# EAGLE design BusPirate-v4a (EAGLE 5.07)
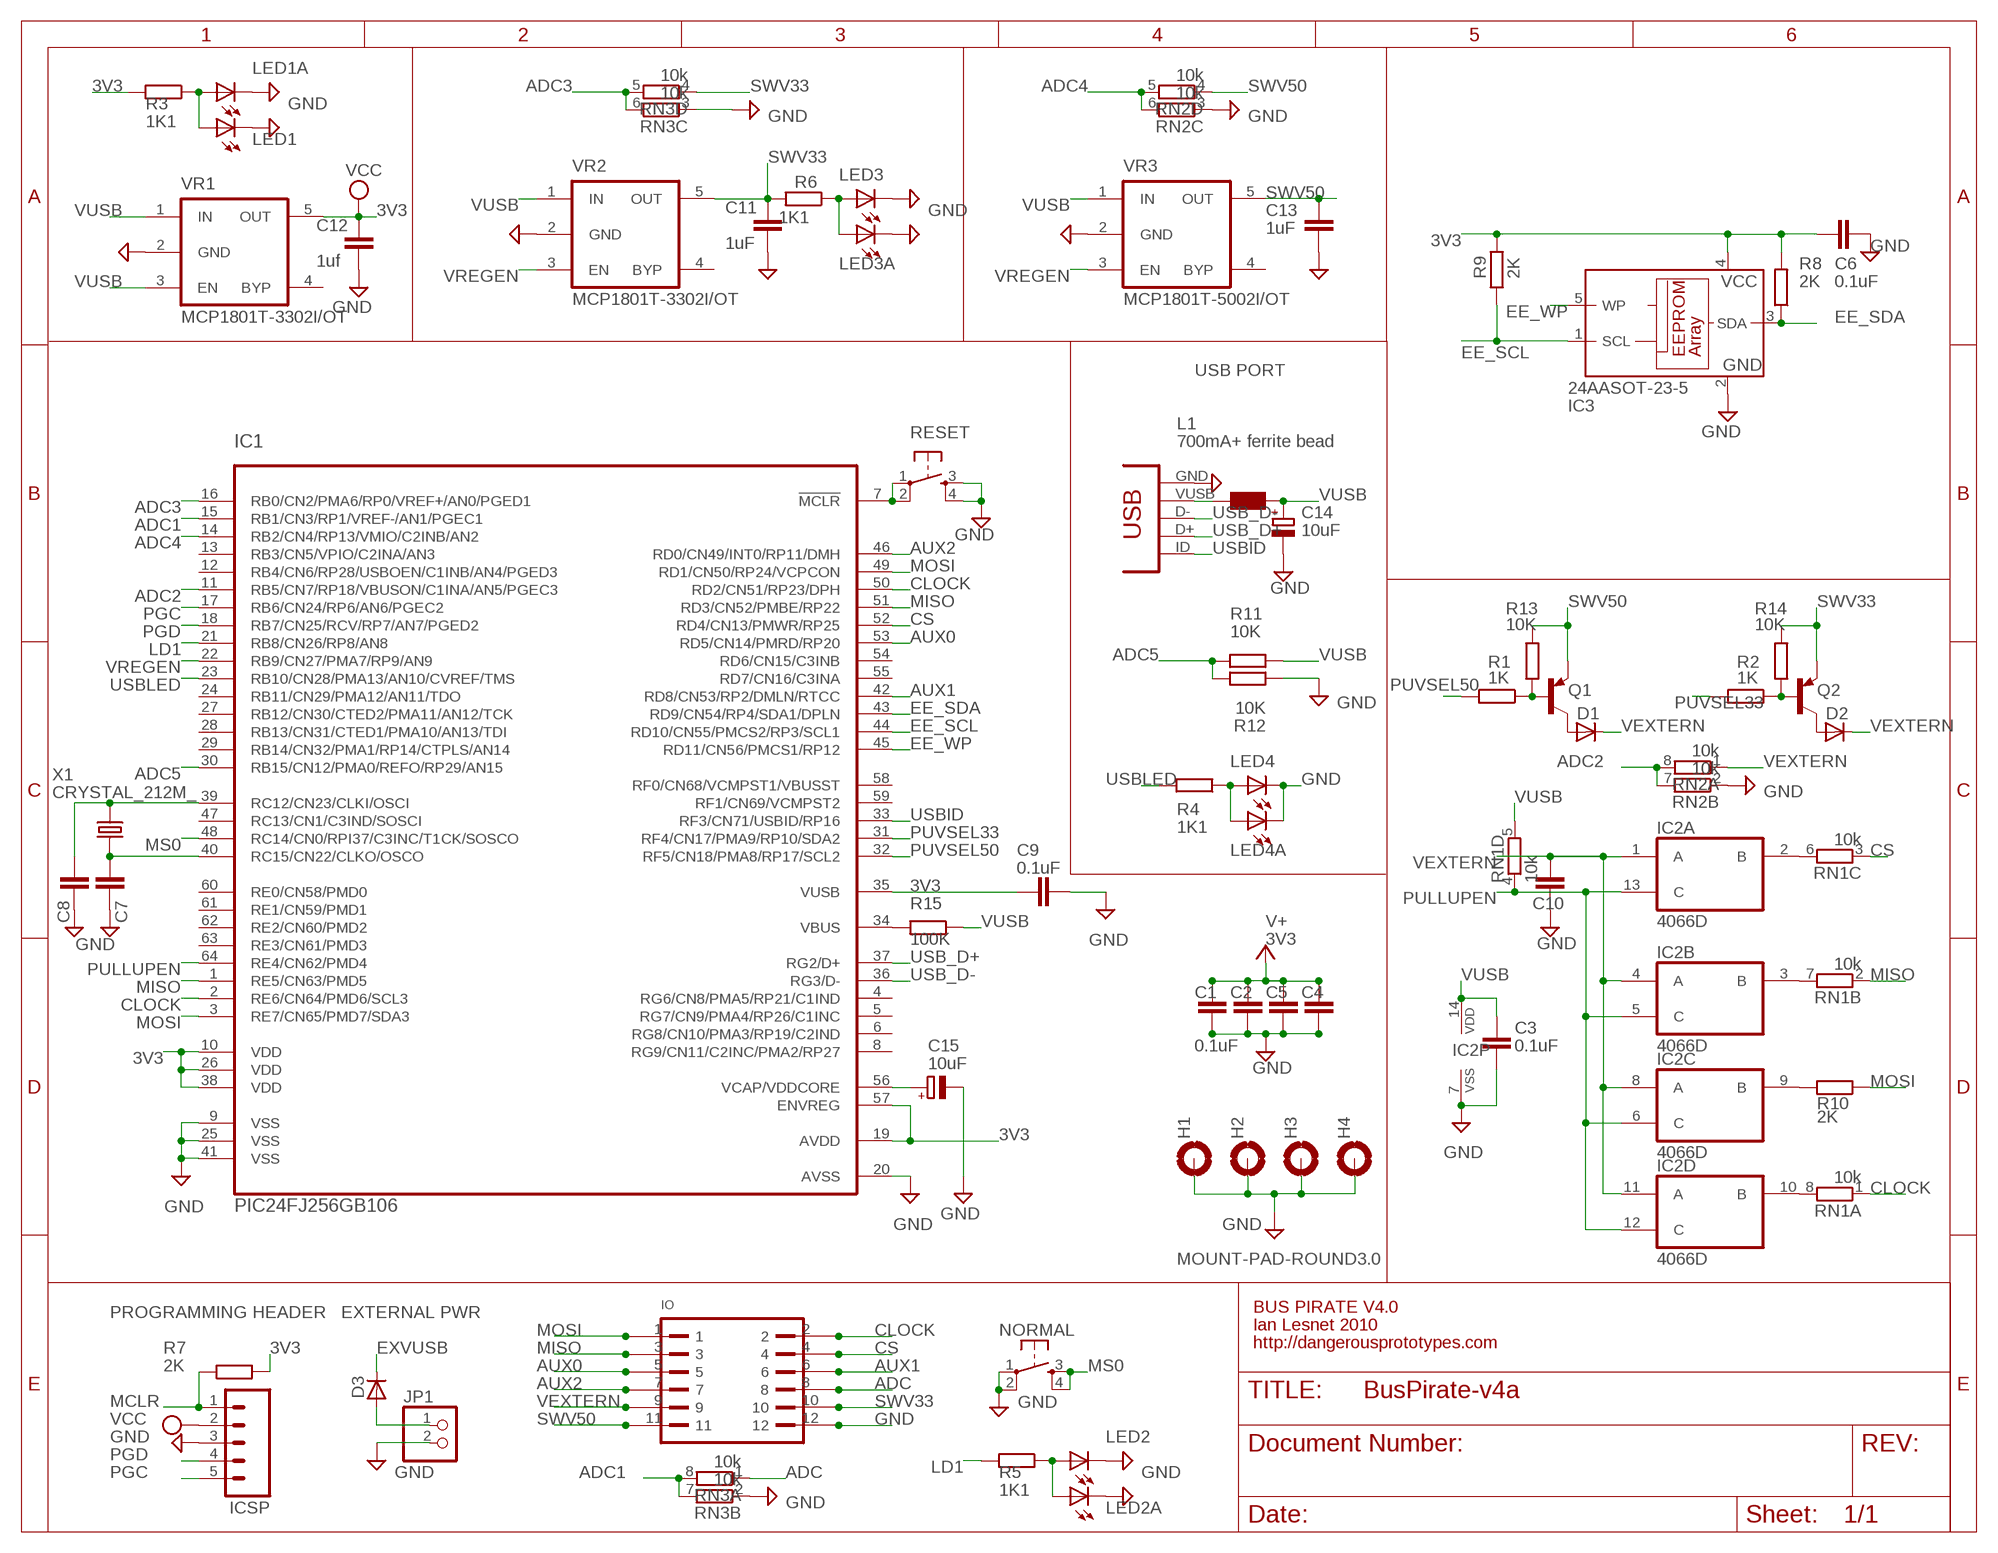
[diagram p0: schematic, sheet 1]

## Parts
C1  0.1uF  C-EUC0603  [C0603]
C2  0.1uF  C-EUC0603  [C0603]
C3  0.1uF  C-EUC0603  [C0603]
C4  0.1uF  C-EUC0603  [C0603]
C5  0.1uF  C-EUC0603  [C0603]
C6  0.1uF  C-EUC0603  [C0603]
C7  0.1uF  C-EUC0603  [C0603]
C8  0.1uF  C-EUC0603  [C0603]
C9  0.1uF  C-EUC0603  [C0603]
C10  0.1uF  C-EUC0603  [C0603]
C11  1uF  C-EUC0603  [C0603]
C12  1uf  C-EUC0603  [C0603]
C13  1uF  C-EUC0603  [C0603]
C14  10uF  CPOL-EUSMCA  [SMC_A]
C15  10uF  CPOL-EUSMCA  [SMC_A]
D1  MBR0520LT  [SOD123]
D2  MBR0520LT  [SOD123]
D3  MBR0520LT  [SOD123]
H1  MOUNT-PAD-ROUND3.0  [3,0-PAD]
H2  MOUNT-PAD-ROUND3.0  [3,0-PAD]
H3  MOUNT-PAD-ROUND3.0  [3,0-PAD]
H4  MOUNT-PAD-ROUND3.0  [3,0-PAD]
IC1  PIC24FJ256GB106  [TQFP64-10X10]
IC2  4066D  [SO14]
IC3  24AASOT-23-5  24AA  [SOT-23-5]
ICSP  ICSP  M05  [1X05]
IO  PINSHRD-PTH-2X06  [PINSHRD_PTH_2X06]
JP1  PINHD-1X02_2.54-S  [1X02-S]
L1  700mA+ ferrite bead  WE-KIL_0805  [WE-KI_0805_B]
LED1  LEDCHIP-LED0805  [CHIP-LED0805]
LED1A  LEDCHIP-LED0805  [CHIP-LED0805]
LED2  LEDCHIP-LED0805  [CHIP-LED0805]
LED2A  LEDCHIP-LED0805  [CHIP-LED0805]
LED3  LEDCHIP-LED0805  [CHIP-LED0805]
LED3A  LEDCHIP-LED0805  [CHIP-LED0805]
LED4  LEDCHIP-LED0805  [CHIP-LED0805]
LED4A  LEDCHIP-LED0805  [CHIP-LED0805]
NORMAL  SMD_TACT_SMALL  [TACT_SWITCH_SMALL]
Q1  MMBTA56-SOT23  [SOT23]
Q2  MMBTA56-SOT23  [SOT23]
R1  1K  R-EU_R0603  [R0603]
R2  1K  R-EU_R0603  [R0603]
R3  1K1  R-EU_R0603  [R0603]
R4  1K1  R-EU_R0603  [R0603]
R5  1K1  R-EU_R0603  [R0603]
R6  1K1  R-EU_R0603  [R0603]
R7  2K  R-EU_R0603  [R0603]
R8  2K  R-EU_R0603  [R0603]
R9  2K  R-EU_R0603  [R0603]
R10  2K  R-EU_R0603  [R0603]
R11  10K  R-EU_R0603  [R0603]
R12  10K  R-EU_R0603  [R0603]
R13  10K  R-EU_R0603  [R0603]
R14  10K  R-EU_R0603  [R0603]
R15  100K  R-EU_R0603  [R0603]
RESET  SMD_TACT_SMALL  [TACT_SWITCH_SMALL]
RN1  10k  RNETWORK  [RN8P-4R-CRA06S]
RN2  10k  RNETWORK  [RN8P-4R-CRA06S]
RN3  10k  RNETWORK  [RN8P-4R-CRA06S]
USB  USB mini-b  CONN_USB  [CONN_USB_MINI-B]
VR1  MCP1801T-3302I/OT  MIC5205  [SOT-23-5]
VR2  MCP1801T-3302I/OT  MIC5205  [SOT-23-5]
VR3  MCP1801T-5002I/OT  MIC5205  [SOT-23-5]
X1  CRYSTAL_212M_  [4X6]

## Nets
3V3: C1.1 C2.1 C4.1 C5.1 C6.1 C9.1 C12.1 IC1.10(VDD) IC1.19(AVDD) IC1.26(VDD) IC1.35(VUSB) IC1.38(VDD) IC1.57(ENVREG) IC3.4(VCC) ICSP.2 R3.2 R7.2 R8.2 R9.2 VR1.5(OUT) ; supply symbol labelled VCC, V+
ADC: IO.8 RN3.1
ADC1: IC1.15(RB1/CN3/RP1/VREF-/AN1/PGEC1) RN3.7 RN3.8
ADC2: IC1.11(RB5/CN7/RP18/VBUSON/C1INA/AN5/PGEC3) RN2.7 RN2.8
ADC3: IC1.16(RB0/CN2/PMA6/RP0/VREF+/AN0/PGED1) RN3.5 RN3.6
ADC4: IC1.14(RB2/CN4/RP13/VMIO/C2INB/AN2) RN2.5 RN2.6
ADC5: IC1.30(RB15/CN12/PMA0/REFO/RP29/AN15) R11.2 R12.2
AUX0: IC1.53(RD5/CN14/PMRD/RP20) IO.5
AUX1: IC1.42(RD8/CN53/RP2/DMLN/RTCC) IO.6
AUX2: IC1.46(RD0/CN49/INT0/RP11/DMH) IO.7
CLOCK: IC1.2(RE6/CN64/PMD6/SCL3) IC1.50(RD2/CN51/RP23/DPH) IO.2 RN1.1
CS: IC1.52(RD4/CN13/PMWR/RP25) IO.4 RN1.3
EE_SCL: IC1.44(RD10/CN55/PMCS2/RP3/SCL1) IC3.1(SCL) R9.1
EE_SDA: IC1.43(RD9/CN54/RP4/SDA1/DPLN) IC3.3(SDA) R8.1
EE_WP: IC1.45(RD11/CN56/PMCS1/RP12) IC3.5(WP)
EXVUSB: D3.C L1.2 USB.VUSB
GND: C1.2 C2.2 C3.2 C4.2 C5.2 C6.2 C7.2 C8.2 C9.2 C10.2 C11.2 C12.2 C13.2 C14.- C15.- H1.B3,0(MOUNT) H2.B3,0(MOUNT) H3.B3,0(MOUNT) H4.B3,0(MOUNT) IC1.9(VSS) IC1.20(AVSS) IC1.25(VSS) IC1.41(VSS) IC2.7(P:VSS) IC3.2(GND) ICSP.3 IO.12 JP1.2 LED1.C LED1A.C LED2.C LED2A.C LED3.C LED3A.C LED4.C LED4A.C NORMAL.1 NORMAL.2 R12.1 RESET.3 RESET.4 RN2.2 RN2.3 RN3.2 RN3.3 USB.GND VR1.2(GND) VR2.2(GND) VR3.2(GND)
LD1: IC1.21(RB8/CN26/RP8/AN8) R5.2
MCLR: IC1.7(!MCLR) ICSP.1 R7.1 RESET.1 RESET.2
MISO: IC1.1(RE5/CN63/PMD5) IC1.51(RD3/CN52/PMBE/RP22) IO.3 RN1.2
MOSI: IC1.3(RE7/CN65/PMD7/SDA3) IC1.49(RD1/CN50/RP24/VCPCON) IO.1 R10.1
MS0: IC1.48(RC14/CN0/RPI37/C3INC/T1CK/SOSCO) NORMAL.3 NORMAL.4
N$1: IC2.9(C:B) R10.2
N$2: IC2.10(D:B) RN1.8
N$3: D1.A Q1.3(C)
N$4: IC2.2(A:B) RN1.6
N$5: IC2.3(B:B) RN1.7
N$6: LED2.A LED2A.A R5.1
N$7: LED1.A LED1A.A R3.1
N$8: Q2.1(B) R2.1 R14.2
N$9: C7.1 IC1.40(RC15/CN22/CLKO/OSCO) X1.2(X2)
N$10: C15.+ IC1.56(VCAP/VDDCORE)
N$11: IC1.34(VBUS) R15.2
N$12: C8.1 IC1.39(RC12/CN23/CLKI/OSCI) X1.1(X1)
N$13: LED4.A LED4A.A R4.1
N$14: D2.A Q2.3(C)
N$15: D3.A JP1.1
N$17: Q1.1(B) R1.1 R13.2
N$18: LED3.A LED3A.A R6.1
PGC: IC1.17(RB6/CN24/RP6/AN6/PGEC2) ICSP.5
PGD: IC1.18(RB7/CN25/RCV/RP7/AN7/PGED2) ICSP.4
PULLUPEN: IC1.64(RE4/CN62/PMD4) IC2.5(B:C) IC2.6(C:C) IC2.12(D:C) IC2.13(A:C) RN1.4
PUVSEL33: IC1.31(RF4/CN17/PMA9/RP10/SDA2) R2.2
PUVSEL50: IC1.32(RF5/CN18/PMA8/RP17/SCL2) R1.2
SWV33: C11.1 IO.10 Q2.2(E) R6.2 R14.1 RN3.4 VR2.5(OUT)
SWV50: C13.1 IO.11 Q1.2(E) R13.1 RN2.4 VR3.5(OUT)
USB_D+: IC1.37(RG2/D+) USB.D+
USB_D-: IC1.36(RG3/D-) USB.D-
USBID: IC1.33(RF3/CN71/USBID/RP16) USB.ID(USBID)
USBLED: IC1.23(RB10/CN28/PMA13/AN10/CVREF/TMS) R4.2
VEXTERN: C10.1 D1.C D2.C IC2.1(A:A) IC2.4(B:A) IC2.8(C:A) IC2.11(D:A) IO.9 RN2.1
VREGEN: IC1.22(RB9/CN27/PMA7/RP9/AN9) VR2.3(EN) VR3.3(EN)
VUSB: C3.1 C14.+ IC2.14(P:VDD) L1.1 R11.1 R15.1 RN1.5 VR1.1(IN) VR1.3(EN) VR2.1(IN) VR3.1(IN)
Unconnected: IC1.4(RG6/CN8/PMA5/RP21/C1IND) IC1.5(RG7/CN9/PMA4/RP26/C1INC) IC1.6(RG8/CN10/PMA3/RP19/C2IND) IC1.8(RG9/CN11/C2INC/PMA2/RP27) IC1.12(RB4/CN6/RP28/USBOEN/C1INB/AN4/PGED3) IC1.13(RB3/CN5/VPIO/C2INA/AN3) IC1.24(RB11/CN29/PMA12/AN11/TDO) IC1.27(RB12/CN30/CTED2/PMA11/AN12/TCK) IC1.28(RB13/CN31/CTED1/PMA10/AN13/TDI) IC1.29(RB14/CN32/PMA1/RP14/CTPLS/AN14) IC1.47(RC13/CN1/C3IND/SOSCI) IC1.54(RD6/CN15/C3INB) IC1.55(RD7/CN16/C3INA) IC1.58(RF0/CN68/VCMPST1/VBUSST) IC1.59(RF1/CN69/VCMPST2) IC1.60(RE0/CN58/PMD0) IC1.61(RE1/CN59/PMD1) IC1.62(RE2/CN60/PMD2) IC1.63(RE3/CN61/PMD3) USB.BODY@1(BODY) USB.BODY@2(BODY) USB.BODY@3(BODY) USB.BODY@4(BODY) VR1.4(BYP) VR2.4(BYP) VR3.4(BYP)

## Notes on the sheet
- USB PORT
- BUS PIRATE V4.0
- PROGRAMMING HEADER | EXTERNAL PWR
- Ian Lesnet 2010
- http://dangerousprototypes.com

## Library data of the parts
C1-C13 = rcl:C-EU: CAPACITOR, European symbol
C14 C15 = rcl:CPOL-EU: POLARIZED CAPACITOR, European symbol
D1-D3 = diode:MBR0520LT: SCHOTTKY BARRIER RECTIFIER Source: http://onsemi.com .. MBR0520LT1-D.pdf
H1-H4 = holes:MOUNT-PAD-ROUND: MOUNTING PAD, round
IC1 = dp_devices:PIC24FJ256GB106: 16-Bit Flash Microcontroller with USB On-The-Go(OTG)
IC2 = 40xx:4066: Quad bilateral ANALOG SWITCH
IC3 = dp_devices:24AA*; 24AA: 24AA
ICSP = SparkFun:M05: Header 5 Standard 5-pin 0.1" header. Use with straight break away headers (SKU : PRT-00116), right angle break away headers (PRT-00553), swiss pins (PRT-00743), machine pins (PRT-00117), and female headers (PRT-00115). Molex polarized connector foot print use with SKU : PRT-08230 with associated crimp pins and housings.
IO = dp_devices:PINSHRD-PTH-2X06: Shrouded pin header, 2.54mm pitch
JP1 = pinhead-2:PINHD-1X02: PIN HEADER
L1 = wuerth-elektronik:WE-KIL: SMD Wire Wound Ceramic Inductor WE-KIL - Low profile - High Q values -- Bluetooth -- Wireless LAN -- RF oscillation circuit -- IF impedance matching
LED1 LED1A LED2 LED2A LED3 LED3A LED4 LED4A = led:LED: LED OSRAM: - CHIPLED LG R971, LG N971, LY N971, LG Q971, LY Q971, LO R971, LY R971 LH N974, LH R974 LS Q976, LO Q976, LY Q976 LO Q996 - Hyper CHIPLED LW Q18S LB Q993, LB Q99A, LB R99A - SideLED LS A670, LO A670, LY A670, LG A670, LP A670 LB A673, LV A673, LT A673, LW A673 LH A674 LY A675 LS A676, LA A676, LO A676, LY A676, LW A676 LS A679, LY A679, LG A679 - Hyper Micro SIDELED® LS Y876, LA Y876, LO Y876, LY Y876 LT Y87S - SmartLED LW L88C, LW L88S LB L89C, LB L89S, LG L890 LS L89K, LO L89K, LY L89K LS L896, LA L896, LO L896, LY L896 - TOPLED LS T670, LO T670, LY T670, LG T670, LP T670 LSG T670, LSP T670, LSY T670, LOP T670, LYG T670 LG T671, LOG T671, LSG T671 LB T673, LV T673, LT T673, LW T673 LH T674 LS T676, LA T676, LO T676, LY T676, LB T676, LH T676, LSB T676, LW T676 LB T67C, LV T67C, LT T67C, LS T67K, LO T67K, LY T67K, LW E67C LS E67B, LA E67B, LO E67B, LY E67B, LB E67C, LV E67C, LT E67C LW T67C LS T679, LY T679, LG T679 LS T770, LO T770, LY T770, LG T770, LP T770 LB T773, LV T773, LT T773, LW T773 LH T774 LS E675, LA E675, LY E675, LS T675 LS T776, LA T776, LO T776, LY T776, LB T776 LHGB T686 LT T68C, LB T68C - Hyper Mini TOPLED® LB M676 - Mini TOPLED Santana® LG M470 LS M47K, LO M47K, LY M47K Source: http://www.osram.convergy.de LUXEON: - LUMILED® LXK2-PW12-R00, LXK2-PW12-S00, LXK2-PW14-U00, LXK2-PW14-V00 LXK2-PM12-R00, LXK2-PM12-S00, LXK2-PM14-U00 LXK2-PE12-Q00, LXK2-PE12-R00, LXK2-PE12-S00, LXK2-PE14-T00, LXK2-PE14-U00 LXK2-PB12-K00, LXK2-PB12-L00, LXK2-PB12-M00, LXK2-PB14-N00, LXK2-PB14-P00, LXK2-PB14-Q00 LXK2-PR12-L00, LXK2-PR12-M00, LXK2-PR14-Q00, LXK2-PR14-R00 LXK2-PD12-Q00, LXK2-PD12-R00, LXK2-PD12-S00 LXK2-PH12-R00, LXK2-PH12-S00 LXK2-PL12-P00, LXK2-PL12-Q00, LXK2-PL12-R00 Source: www.luxeon.com KINGBRIGHT: KA-3528ASYC Source: www.kingbright.com
NORMAL RESET = dp_devices:SMD_TACT_SMALL
Q1 Q2 = transistor-pnp:*-?: PNP Transistor
R1-R3 R5-R10 R13-R15 = rcl:R-EU_: RESISTOR, European symbol
R4 R11 R12 = resistor:R-EU_: RESISTOR, European symbol
RN1-RN3 = dp_devices:RNETWORK: 4 Resistor Array 0603
USB = dp_devices:CONN_USB: USB connector
VR1-VR3 = dp_devices:MIC5205: 150ma Low-Noise LDO Regulator
X1 = dp_devices:CRYSTAL_2

## Board
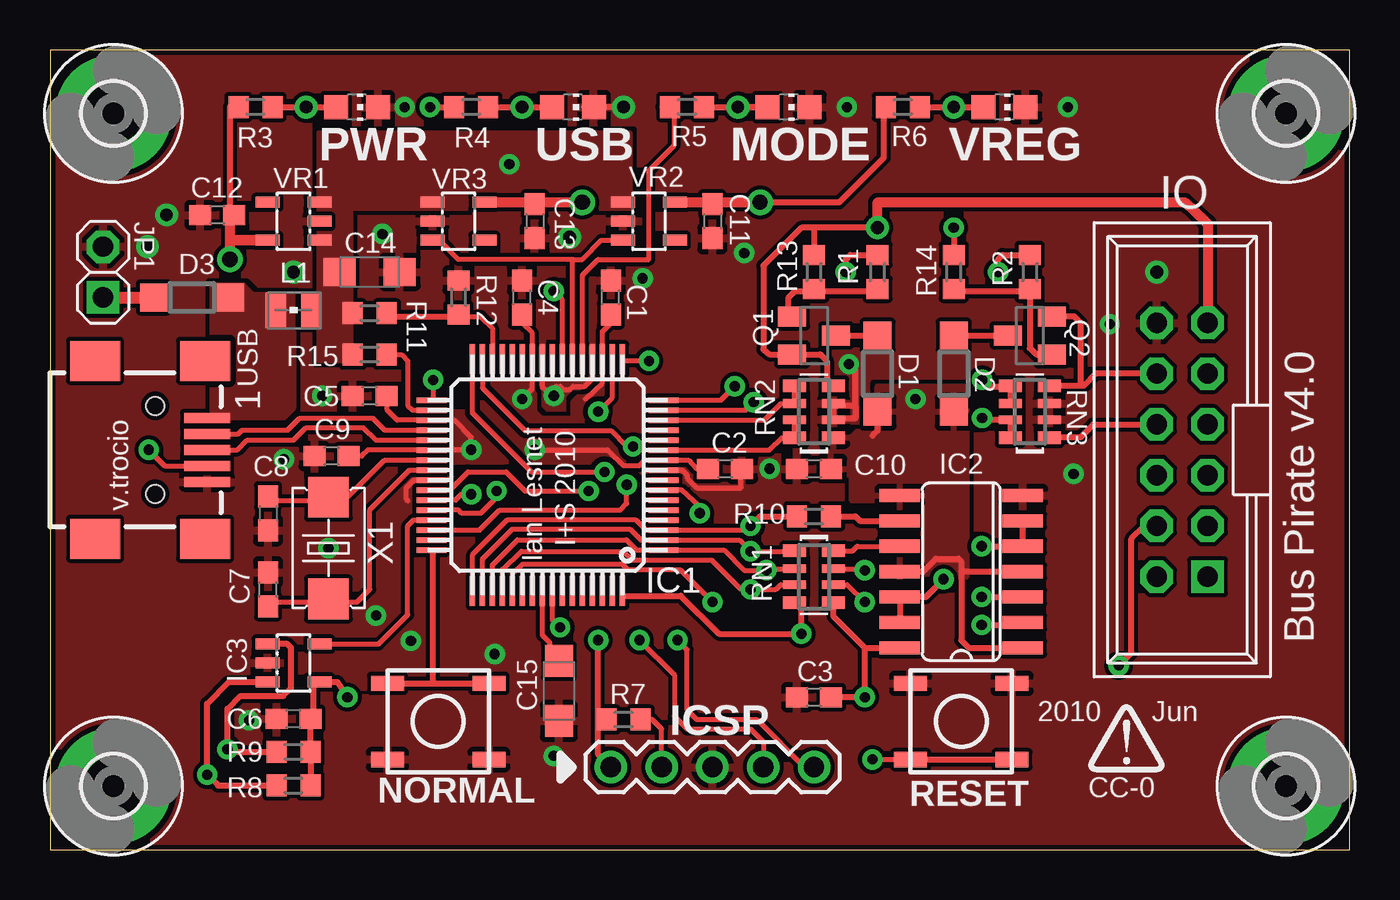
[diagram p1: board, top side]
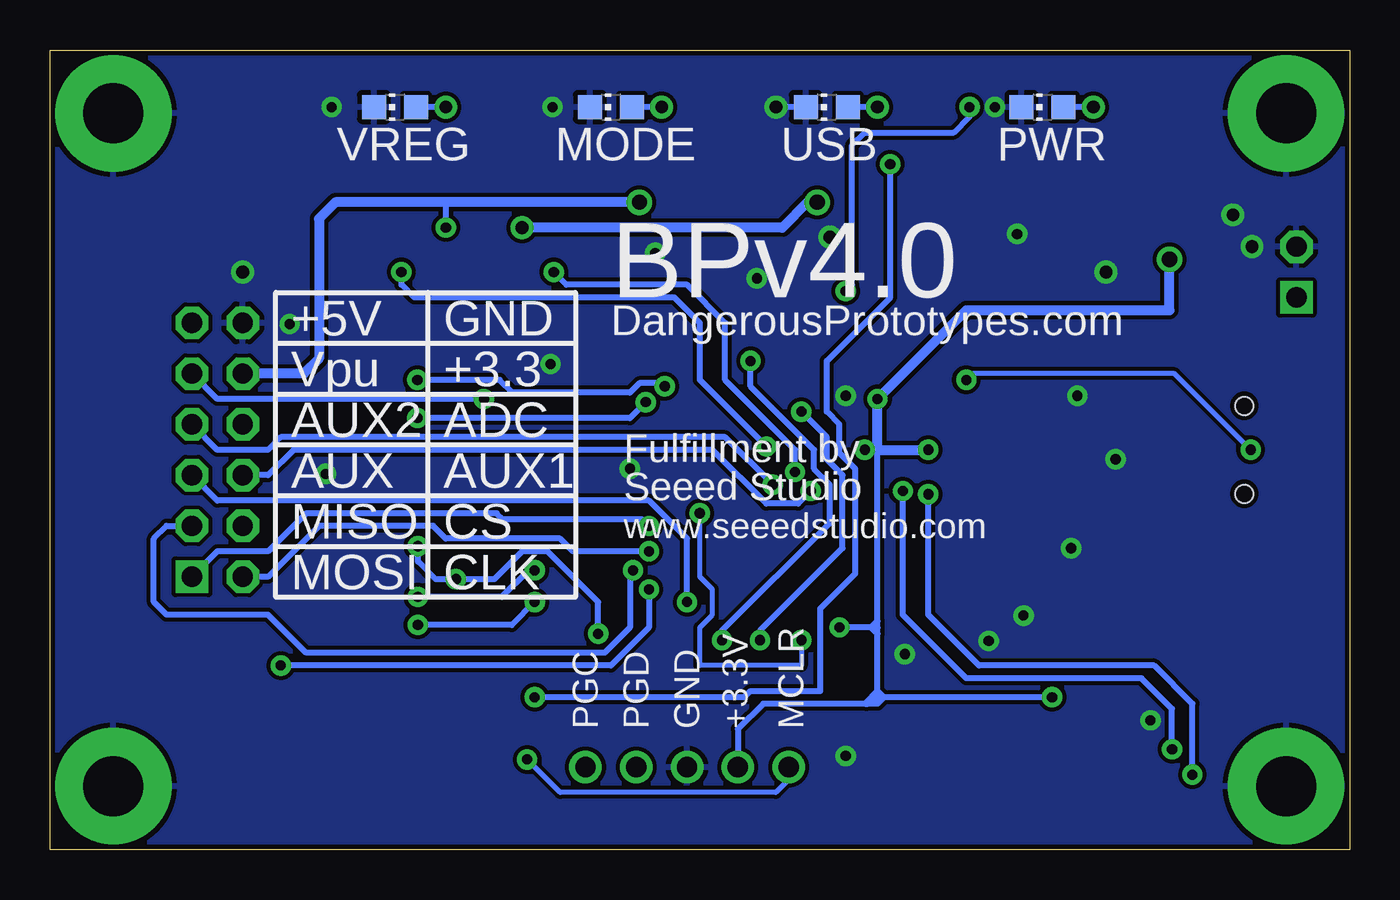
[diagram p2: board, bottom side, seen from below]

Size 65 x 40 mm. Coordinates in mm from the lower left corner, seen from the top.
Outline: 0,40 0,0 65,0 65,40 0,40
Copper layers (1*16): Top 0.035mm / dielectric 1.5mm / Bottom 0.035mm
Design rules "SparkFun": minimum track width 8mil, minimum drill 20mil, track to track 8mil, track to pad 8mil, pad to pad 8mil, via to via 8mil, smd to smd 8mil, copper to edge 10mil, drill to drill 8mil, minimum pad ring 12mil, minimum via ring 10mil, stop-mask expansion 4mil, vias tented up to drill 25mil, thermal gap 10mil

### Footprints (pad centres in the part's own frame; a part is rotated, then mirrored left to right if it is on the bottom)
C0603 = smd 1.1 x 1: 1 -0.85,0; 2 0.85,0
SMC_A = smd 1.6 x 1.4: + -1.5,0; - 1.5,0
SOD123 = smd 1.4 x 1.4: A 1.9,0; C -1.9,0
3,0-PAD = drill 3 pad 5.842 round: B3,0 0,0
TQFP64-10X10 = smd 1.5 x 0.28: 1 -5.8,3.75; 2 -5.8,3.25; 3 -5.8,2.75; 4 -5.8,2.25; 5 -5.8,1.75; 6 -5.8,1.25; 7 -5.8,0.75; 8 -5.8,0.25; 9 -5.8,-0.25; 10 -5.8,-0.75; 11 -5.8,-1.25; 12 -5.8,-1.75; 13 -5.8,-2.25; 14 -5.8,-2.75; 15 -5.8,-3.25; 16 -5.8,-3.75; 33 5.8,-3.75; 34 5.8,-3.25; 35 5.8,-2.75; 36 5.8,-2.25; 37 5.8,-1.75; 38 5.8,-1.25; 39 5.8,-0.75; 40 5.8,-0.25; 41 5.8,0.25; 42 5.8,0.75; 43 5.8,1.25; 44 5.8,1.75; 45 5.8,2.25; 46 5.8,2.75; 47 5.8,3.25; 48 5.8,3.75 | smd 0.28 x 1.5: 17 -3.75,-5.8; 18 -3.25,-5.8; 19 -2.75,-5.8; 20 -2.25,-5.8; 21 -1.75,-5.8; 22 -1.25,-5.8; 23 -0.75,-5.8; 24 -0.25,-5.8; 25 0.25,-5.8; 26 0.75,-5.8; 27 1.25,-5.8; 28 1.75,-5.8; 29 2.25,-5.8; 30 2.75,-5.8; 31 3.25,-5.8; 32 3.75,-5.8; 49 3.75,5.8; 50 3.25,5.8; 51 2.75,5.8; 52 2.25,5.8; 53 1.75,5.8; 54 1.25,5.8; 55 0.75,5.8; 56 0.25,5.8; 57 -0.25,5.8; 58 -0.75,5.8; 59 -1.25,5.8; 60 -1.75,5.8; 61 -2.25,5.8; 62 -2.75,5.8; 63 -3.25,5.8; 64 -3.75,5.8
SO14 = smd 0.66 x 2.032: 1 -3.81,-3.073; 2 -2.54,-3.073; 3 -1.27,-3.073; 4 0,-3.073; 5 1.27,-3.073; 6 2.54,-3.073; 7 3.81,-3.073; 8 3.81,3.073; 9 2.54,3.073; 10 1.27,3.073; 11 0,3.073; 12 -1.27,3.073; 13 -2.54,3.073; 14 -3.81,3.073
SOT-23-5 = smd 0.55 x 1.2: 1 -0.95,-1.3; 2 0,-1.3; 3 0.95,-1.3; 4 0.95,1.3; 5 -0.95,1.3
1X05 = drill 1.016 round: 1 0,0; 2 2.54,0; 3 5.08,0; 4 7.62,0; 5 10.16,0
PINSHRD_PTH_2X06 = drill 1.016 square: 1 -6.35,-1.27 | drill 1.016 octagon: 2 -6.35,1.27; 3 -3.81,-1.27; 4 -3.81,1.27; 5 -1.27,-1.27; 6 -1.27,1.27; 7 1.27,-1.27; 8 1.27,1.27; 9 3.81,-1.27; 10 3.81,1.27; 11 6.35,-1.27; 12 6.35,1.27
1X02-S = drill 1.016 square: 1 -1.27,0 | drill 1.016 octagon: 2 1.27,0
WE-KI_0805_B = smd 1.02 x 1.78: 1 -0.89,0; 2 0.89,0
CHIP-LED0805 = smd 1.2 x 1.2: A 0,-1.05; C 0,1.05
TACT_SWITCH_SMALL = smd 1.651 x 0.762: 1 -2.54,1.905; 2 2.54,1.905; 3 -2.54,-1.905; 4 2.54,-1.905
SOT23 = smd 1 x 1.4: 1 -0.95,-1.1; 2 0.95,-1.1; 3 0,1.1
R0603 = smd 1 x 1.1: 1 -0.85,0; 2 0.85,0
RN8P-4R-CRA06S = smd 0.63 x 1.15: 1 -1.295,-0.975; 4 1.295,-0.975; 5 1.295,0.975; 8 -1.295,0.975 | smd 0.44 x 1.15: 2 -0.4,-0.975; 3 0.4,-0.975; 6 0.4,0.975; 7 -0.4,0.975
CONN_USB_MINI-B = smd 2 x 2.5: BODY@1 -4.45,2.5; BODY@2 4.45,2.5; BODY@3 4.45,-3; BODY@4 -4.45,-3 | smd 0.5 x 2.3: D+ 0,2.6; D- -0.8,2.6; GND 1.6,2.6; ID 0.8,2.6; VUSB -1.6,2.6 | hole 0.9: -2.2,0; 2.2,0
4X6 = smd 2.032 x 2.032: 1 -2.54,0; 2 2.54,0

### Placement (x,y rotation side)
C1  28.05,27.62 90 top
C2  33.77,19.05 0 top
C3  38.22,7.62 180 top
C4  23.61,27.62 90 top
C5  15.99,22.7 180 top
C6  12.18,6.54 180 top
C7  10.91,13.02 90 top
C8  10.91,16.82 270 top
C9  14.09,19.68 180 top
C10  38.22,19.05 180 top
C11  33.13,31.43 270 top
C12  8.37,31.75 180 top
C13  24.25,31.43 270 top
C14  15.99,28.89 0 top
C15  25.45,7.93 270 top
D1  41.39,23.81 90 top
D2  45.2,23.81 90 top
D3  7.1,27.62 180 top
H1  3.17,3.17 0 top
H2  61.83,3.17 0 top
H3  61.83,36.83 0 top
H4  3.17,36.83 0 top
IC1  24.88,18.73 180 top
IC2  45.58,13.9 90 top
IC3  12.18,9.33 270 top
ICSP  28.05,4.12 0 top
IO  56.63,20 90 top
JP1  2.65,28.89 90 top
L1  12.18,26.98 180 top
LED1  15.36,37.15 270 top
LED1A  15.36,37.15 90 bottom
LED2  36.95,37.15 270 top
LED2A  36.95,37.15 90 bottom
LED3  47.74,37.15 270 top
LED3A  47.74,37.15 90 bottom
LED4  26.15,37.15 270 top
LED4A  26.15,37.15 90 bottom
NORMAL  19.42,6.41 180 top
Q1  38.22,25.71 270 top
Q2  49.01,25.71 90 top
R1  41.39,28.89 90 top
R2  49.01,28.89 90 top
R3  10.28,37.15 180 top
R4  21.07,37.15 180 top
R5  31.86,37.15 180 top
R6  42.66,37.15 180 top
R7  28.69,6.51 0 top
R8  12.18,3.2 0 top
R9  12.18,4.89 0 top
R10  38.22,16.67 0 top
R11  15.99,26.83 0 top
R12  20.43,27.62 270 top
R13  38.22,28.89 270 top
R14  45.2,28.89 270 top
R15  15.99,24.76 0 top
RESET  45.58,6.41 180 top
RN1  38.22,13.65 270 top
RN2  38.22,21.91 90 top
RN3  49.01,21.91 90 top
U$1  [DP-LOGO]  51.93,3.87 0 top
USB  5.26,20 270 top
VR1  12.18,31.43 90 top
VR2  29.96,31.43 270 top
VR3  20.43,31.43 270 top
X1  13.93,15.08 270 top

### Tracks (layer width: path | path; a pad name or v marks a point on that pad's centre or on a via)
3V3  (via drill 0.51, 0.76)
  Top 0.254: 16.78,22.54 C5.1 16.86,22.68 16.86,21.98 17.37,21.48 IC1.35 20.23,21.48 21.07,20.64 v21.07,20 | C1.1 28.05,26.35 27.63,25.93 IC1.19 27.63,23.34 26.79,22.54 | C4.1 23.61,26.35 24.13,25.83 IC1.26 24.13,23.06 v23.61,22.54 | C2.1 32.34,19.05 31.93,19.48 IC1.10 29.76,19.48 29.48,19.21 28.69,19.21 27.9,20 v24.25,20 | R7.2 30.12,6.51 30.59,6.03 ICSP.2 | C9.1 15.59,19.68 15.91,20 20.91,20 v21.07,20 | IC1.38 20.89,19.98 v21.07,20 | IC1.57 25.13,11.49 v25.52,11.11
  Top 0.305: 9.64,37.15 R3.2 9.01,37.15 9.01,31.75 | v14.88,7.62 14.37,8.38 IC3.4 13.2,8.35 13.2,6.79 13.03,6.63 C6.1 R9.2 | R9.2 | R9.2 R8.2
  Top 0.508: v9.01,29.52 9.01,29.84 9,30.48 VR1.5 9.29,30.48 9.01,30.48 9.01,31.75 C12.1
  Bottom 0.305: 23.61,11.11 23.61,11.43 | 23.61,11.43 23.61,20 | v14.88,7.62 23.29,7.62 | 23.29,7.62 23.61,7.62 | ICSP.2 30.59,6.03 29.32,7.3 24.25,7.3 | 23.61,7.3 23.93,7.3 | 23.93,7.3 24.09,7.3 | 23.61,11.11 23.93,11.11 | 23.93,11.11 v25.52,11.11 | 23.61,7.62 23.61,7.78 | 23.61,7.93 23.61,7.78 | 23.61,7.93 23.61,10.79 | 23.61,10.79 23.61,11.11 | 23.61,7.62 23.61,7.3 | 23.61,7.62 23.93,7.3 | 23.29,7.62 23.61,7.93 | 23.29,7.62 23.61,7.3 | 23.61,7.78 24.09,7.3 | 24.25,7.3 24.09,7.3 | 23.61,7.93 24.25,7.3 | 23.93,11.11 23.61,11.43 | 23.61,10.79 23.93,11.11
  Bottom 0.508: v9.01,29.52 9.01,26.98 19.16,26.98 v23.61,22.54 | 23.61,20 v23.61,22.54 | 23.61,20 v21.07,20 | v23.61,22.54 | 23.61,20 v24.25,20 | 23.61,20 v23.61,22.54
  pour Top (isolate 0.254, no thermals): 21.07,25.71 23.61,25.71 24.25,25.08 24.25,21.91 24.56,21.59 26.15,21.59 26.15,22.38 26.94,23.18 29.32,23.18 29.32,19.36 19.16,19.36 19.16,21.91 21.07,21.91
ADC
  Top 0.305: IO.8 52.19,21.27 51.55,20.64 50.28,20.64 50.26,20.61 RN3.1
ADC1  (via drill 0.51)
  Top 0.254: IC1.15 34.8,21.98 v35.2,22.38
  Top 0.305: RN3.8 RN3.7 46.71,21.5 v46.63,21.59
  Bottom 0.305: v46.63,21.59 35.99,21.59 v35.2,22.38 | v35.2,22.38
ADC2
  Top 0.254: IC1.11 35.97,19.98 36.6,20.61 RN2.8 RN2.7
ADC3  (via drill 0.51)
  Top 0.254: IC1.16 33.55,22.48 v34.25,23.18
  Top 0.305: 48.31,23.18 48.06,23.18 RN3.5 | RN3.5 RN3.6 | RN3.5 | RN3.5 47.76,23.2 47.74,23.18 46.95,23.18 v46.63,23.49
  Bottom 0.305: v34.25,23.18 | v34.25,23.18 34.41,23.33 35.52,23.33 35.99,22.86 41.87,22.86 42.5,23.49 v46.63,23.49
ADC4
  Top 0.254: RN2.5 RN2.6 36.55,22.3 35.73,21.48 IC1.14
ADC5
  Top 0.254: IC1.30 22.13,26.08 21.55,26.67 20.54,26.67 R12.2
  Top 0.305: R11.2 16.84,26.77 16.94,26.67 20.33,26.67 R12.2
AUX0  (via drill 0.51)
  Top 0.254: IC1.53 23.13,13.8 23.65,14.29 28.61,14.29 28.89,14.01 31.51,14.01 v33.13,12.38
  Bottom 0.305: v33.13,12.38 33.13,15.55 35.04,17.46 56.63,17.46 IO.5
AUX1  (via drill 0.51)
  Top 0.254: IC1.42 20,17.98 20.91,18.89 22.82,18.89 23.77,17.94 v26.94,17.94
  Bottom 0.305: IO.6 54.09,18.73 52.82,20 31.86,20 29.17,17.3 27.58,17.3 v26.94,17.94
AUX2  (via drill 0.51)
  Top 0.254: IC1.46 21.5,15.98 22.5,16.98 28.53,16.98 28.85,17.3 v28.85,18.25
  Bottom 0.305: IO.7 56.63,20 54.09,20 53.45,20.64 31.23,20.64 v28.85,18.25
CLOCK  (via drill 0.51)
  Top 0.254: IC1.50 21.63,14.53 23.13,16.03 29.01,16.03 29.56,15.48 IC1.2 34.48,15.48 v35.04,14.92 36.79,14.92 36.81,14.95 RN1.1 37.15,14.85 37.02,14.85 36.95,14.92
  Bottom 0.305: v35.04,14.92 38.85,14.92 39.48,15.55 45.2,15.55 45.84,16.19 51.55,16.19 54.09,13.65 IO.2
CS  (via drill 0.51)
  Top 0.254: IC1.52 22.63,14.02 23.57,14.92 28.69,14.92 29.13,14.48 33.09,14.48 34.56,13.02 v35.04,13.02 36.31,13.02 36.55,13.25 RN1.3
  Top 0.305: IO.4 54.73,16.19 54.09,15.55 54.09,9.84 v53.45,9.21
  Bottom 0.305: v53.45,9.21 36.95,9.21 35.52,10.63 | 35.52,10.63 | 35.52,10.63 35.04,11.11 v35.04,13.02
EE_SCL  (via drill 0.51)
  Top 0.254: IC1.44 20.44,16.98 20.59,16.82 21.55,16.82 22.34,17.62 v22.34,17.94
  Top 0.305: R9.1 9.01,4.89 v8.88,5.01 8.88,7.05 9.51,7.68 11.67,7.68 12.05,8.06 12.05,10.09 11.87,10.28 IC3.1
  Bottom 0.305: v8.88,5.01 8.88,7.05 10.4,8.57 19.16,8.57 22.34,11.74 v22.34,17.94
EE_SDA  (via drill 0.51)
  Top 0.254: IC1.43 20.3,17.48 20.59,17.78 v21.07,17.78
  Top 0.305: R8.1 8.4,3.2 v7.86,3.74 7.86,7.3 8.94,8.38 IC3.3
  Bottom 0.305: v7.86,3.74 7.86,7.3 9.77,9.21 18.53,9.21 21.07,11.74 v21.07,17.78
EE_WP
  Top 0.254: IC1.45 18.18,16.48 17.89,16.19 17.89,11.74 16.43,10.28 IC3.5
EXVUSB
  pour Top (isolate 0.305, no thermals): 8.12,23.18 9.39,23.18 9.39,25.71 8.12,25.71 8.12,28.25 9.64,28.25 10.12,27.78 12.18,27.78 12.18,22.06 11.7,21.59 8.12,21.59
GND  (via drill 0.51, 0.64)
  Top 0.254: IC1.25 24.63,23.11 v25.2,22.7 25.2,23.06 25.32,23.18 25.52,23.18 25.67,23.02 25.99,23.02 26.15,23.18 26.75,23.18 27.13,23.56 IC1.20 | IC1.41 18.2,18.48 17.82,18.09 17.82,17.54 17.89,17.46 | IC1.9 31.61,18.98 31.86,18.73 31.86,18.57 32.34,18.09 34.56,18.09 34.56,18.99 C2.2
  Top 0.305: v39.96,24.29 40.28,24.29 40.28,22.22 | 40.28,22.22 40.28,21.59 39.17,21.59 39.17,22.22 40.28,22.22 | v28.69,37.15 LED4A.C
  Top 0.406: LED4A.C 26.79,37.15
  Bottom 0.254: LED4A.C 27.1,37.15
  Bottom 0.305: LED4A.C v28.69,37.15
  other vias: 51.2,18.79 50.91,37.15 34.72,29.84 39.87,37.15 16.62,30.8 17.74,37.15 29.64,28.57 5.83,31.75 55.36,28.89 35.99,19.05 25.99,30.64 13.61,22.7 12.18,28.89 22.24,9.78 11.7,19.52 13.93,15.08 16.31,11.71 25.2,4.68 4.88,30.16 18.05,10.44 53.01,26.29 9.96,6.46
  pour Top (isolate 0.203, rank 2): 0,40 65,40 65,0 0,0
  pour Bottom (isolate 0.203, rank 2): 0,40 65,40 arc-3 65,0 0,0
LD1
  Top 0.254: IC1.21 26.63,28.73 27.42,29.52 29.96,29.52 29.96,33.97 31.23,35.24 31.23,36.8 R5.2 30.59,37.15
MCLR  (via drill 0.51)
  Top 0.254: IC1.7 31.59,17.98 32.5,17.14 v32.5,16.82 | R7.1 27.58,6.51 27.42,6.67 | v41.14,4.51 RESET.2
  Top 0.305: v27.42,10.47 27.42,6.67 27.42,4.76 ICSP.1 | RESET.2 RESET.1
  Bottom 0.254: v32.5,16.82 32.5,13.65 31.86,13.02 31.86,11.74 32.5,11.11 32.5,9.21 27.42,9.21 v27.42,10.47 | v41.14,4.51 39.48,2.85 28.69,2.85 28.05,3.49 ICSP.1
MISO  (via drill 0.51)
  Top 0.254: IC1.51 22.13,14.24 23.38,15.49 28.83,15.49 29.34,14.98 IC1.1 33.71,14.98 34.72,13.97 v35.83,13.97 35.92,14.05 RN1.2
  Bottom 0.305: IO.3 59.17,16.19 59.8,15.55 59.8,12.38 59.17,11.74 54.09,11.74 52.19,9.84 37.26,9.84 36.47,10.63 | 36.47,10.63 | 36.47,10.63 35.99,11.11 35.99,13.81 v35.83,13.97
MOSI  (via drill 0.51)
  Top 0.254: v35.04,16.19 34.83,15.98 IC1.3 29.81,15.98 29.29,16.51 22.9,16.51 21.15,14.76 21.15,12.97 21.13,12.92 IC1.49
  Top 0.305: R10.1 35.52,16.67 v35.04,16.19
  Bottom 0.305: IO.1 56.63,14.92 54.09,14.92 52.19,16.82 42.66,16.82 42.34,16.51 35.36,16.51 v35.04,16.19
MS0
  Top 0.254: 19.16,14.96 19.09,14.96 IC1.48
  Top 0.305: NORMAL.4 19.16,8.32 | 19.16,8.32 NORMAL.3 | 19.16,8.32 19.16,14.96
N$1
  Top 0.305: IC2.9 40.5,16.44 40.28,16.67 R10.2
N$2
  Top 0.254: IC2.10 40.37,15.17 40.15,14.95 RN1.8
N$3
  Top 0.305: Q1.3 D1.A
N$4  (via drill 0.51)
  Top 0.254: 48.53,11.24 IC2.2 | RN1.6 39.88,13.25 v40.76,12.38
  Top 0.305: v46.6,11.24 48.53,11.24
  Bottom 0.305: v46.6,11.24 41.9,11.24 v40.76,12.38
N$5  (via drill 0.51)
  Top 0.254: IC2.3 48.53,12.51 | RN1.7 40.67,14.05 v40.76,13.97
  Top 0.305: v46.6,12.63 IC2.3
  Bottom 0.305: v46.6,12.63 42.41,12.63 41.07,13.97 v40.76,13.97
N$6  (via drill 0.64)
  Top 0.305: v34.41,37.15 LED2A.A R5.1
  Top 0.406: R5.1 32.85,37.12
  Bottom 0.305: v34.41,37.15 LED2A.A
N$7  (via drill 0.64)
  Top 0.305: LED1A.A v12.81,37.15 R3.1
  Bottom 0.305: v12.81,37.15 LED1A.A
N$8
  Top 0.305: Q2.1 49.33,24.77 49.01,25.08 49.01,27.94 | 49.01,27.94 R2.1 | 49.01,27.94 45.3,27.94 R14.2
N$9
  Top 0.254: C7.1 11.12,12.38 13.45,12.38 13.61,12.54 X1.2 14.09,12.38 15.36,12.38 15.99,13.02 15.99,16.98 17.99,18.98 IC1.40
N$10
  Top 0.254: IC1.56 24.63,10.72 25.01,10.35 25.01,9.88 C15.+
N$11
  Top 0.254: IC1.34 18.14,21.98 17.89,22.22 17.89,24.45 17.58,24.76 R15.2
N$12
  Top 0.254: C8.1 10.91,17.46 | 10.91,17.46 | 10.91,17.46 13.77,17.46 X1.1 14.09,17.46 14.72,17.46 16.74,19.48 IC1.39
N$13  (via drill 0.64)
  Top 0.305: R4.1 v23.61,37.15 LED4A.A
  Bottom 0.305: v23.61,37.15 LED4A.A
N$14
  Top 0.305: Q2.3 D2.A
N$15
  Top 0.61: JP1.1 D3.A
N$17
  Top 0.305: R1.1 41.39,27.94 38.32,27.94 | 38.32,27.94 R13.2 | 38.32,27.94 37.26,27.94 36.95,27.62 36.95,26.84 Q1.1
N$18  (via drill 0.64)
  Top 0.305: LED3A.A v45.2,37.15 R6.1
  Top 0.406: LED3A.A 46.79,37.17
  Bottom 0.305: v45.2,37.15 LED3A.A
PGC  (via drill 0.51)
  Top 0.254: 28.69,24.45 28.68,24.43 | v29.96,24.45 28.69,24.45 | 37.74,4.12 35.36,6.51 32.34,6.51 31.86,6.98 31.86,10 v31.39,10.47 | 28.69,24.45 28.69,24.47 IC1.17
  Top 0.305: 37.74,4.12 ICSP.5
  Bottom 0.305: v29.96,24.45 29.96,23.18 26.79,20 26.79,19.05 25.99,18.25 25.99,16.35 31.39,10.95 v31.39,10.47
PGD  (via drill 0.51)
  Top 0.254: v27.42,21.91 28.13,22.61 IC1.18 | 35.67,4.28 35.67,5.39 35.04,6.03 31.86,6.03 31.23,6.67 31.23,8.73 v29.48,10.47
  Top 0.305: 35.67,4.28 ICSP.4
  Bottom 0.305: v27.42,21.91 26.15,20.64 26.15,19.52 25.36,18.73 25.36,15.08 29.48,10.95 v29.48,10.47
PULLUPEN  (via drill 0.51)
  Top 0.254: IC2.5 48.78,15.3 | 43.42,12.63 IC2.12 | IC1.64 28.63,12.76 28.69,12.7
  Top 0.305: IC2.12 IC2.13 | IC2.6 IC2.5 v46.6,15.17 | 43.42,12.63 43.8,12.63 v44.69,13.52 | 28.69,12.7 31.55,12.7 33.45,10.79 v37.58,10.79 | v37.58,10.79 37.59,10.8 | RN1.4 37.55,12.36 37.58,12.38 v37.58,10.79
  Bottom 0.305: v37.58,10.79 37.58,12.38 40.12,14.92 41.39,14.92 42.79,13.52 v44.69,13.52 45.71,13.52 46.6,14.41 v46.6,15.17
PUVSEL33  (via drill 0.51)
  Top 0.254: IC1.31 21.63,23.09 23.77,20.95 28.05,20.95 28.85,20.16 v29.17,20.16
  Top 0.305: R2.2 47.64,29.74 47.42,29.52 v47.42,28.89
  Bottom 0.305: v47.42,28.89 47.42,28.25 46.79,27.62 33.77,27.62 32.5,26.35 32.5,23.49 v29.17,20.16
PUVSEL50  (via drill 0.51)
  Top 0.254: IC1.32 21.13,21.84 24.09,18.89 v27.74,18.89
  Top 0.305: R1.2 40.02,29.74 39.8,29.52 v39.8,28.89
  Bottom 0.305: v27.74,18.89 27.74,20 31.23,23.49 31.23,26.35 33.13,28.25 39.17,28.25 v39.8,28.89
SWV33  (via drill 0.51, 0.76)
  Top 0.305: v35.52,32.38 39.48,32.38 41.71,34.6 41.71,37.04 R6.2 | v45.2,31.11 R14.1 | 51.7,23.2 RN3.4 | 51.7,23.2 52.31,23.81 IO.10 | Q2.2 51.23,26.66 51.55,26.35 51.55,23.35 51.7,23.2
  Top 0.406: R6.2 41.71,37.15
  Top 0.508: 33.77,32.38 VR2.5 | 33.77,32.38 C11.1 | 33.77,32.38 v35.52,32.38
  Bottom 0.305: 45.2,32.38 v45.2,31.11
  Bottom 0.508: v35.52,32.38 45.2,32.38 50.72,32.38 51.55,31.56 51.55,24.57 52.31,23.81 IO.10
SWV50  (via drill 0.64, 0.76)
  Top 0.305: v41.39,31.11 38.22,31.11 | 38.22,31.11 37.58,31.11 35.67,29.21 35.67,25.02 35.99,24.77 Q1.2 38.53,24.77 38.85,24.45 38.85,23.18 39.16,23.18 RN2.4 39.3,23.2 39.33,23.18 | 38.22,31.11 R13.1
  Top 0.508: VR3.5 24.14,32.38 C13.1 24.35,32.38 v26.63,32.38 | v41.39,31.11 41.39,32.38 56.76,32.38 57.77,31.43 57.9,31.3 IO.11
  Bottom 0.508: v41.39,31.11 28.37,31.11 27.1,32.38 v26.63,32.38
USB_D+
  Top 0.254: USB.D+ 9.39,20 9.87,20.48 12.18,20.48 12.81,21.11 15.67,21.11 16.3,20.48 IC1.37
USB_D-
  Top 0.254: USB.D- 9.42,20.8 9.6,20.98 11.89,20.98 12.5,21.59 16.15,21.59 16.74,20.99 16.76,20.98 IC1.36
USBID  (via drill 0.51)
  Top 0.254: USB.ID 5.74,19.2 v4.94,20 | v19.16,23.49 19.16,22.57 IC1.33
  Bottom 0.254: v4.94,20 8.75,23.81 18.85,23.81 v19.16,23.49
USBLED  (via drill 0.51)
  Top 0.254: IC1.23 25.63,27.5 v25.2,27.94
  Top 0.305: v19.01,37.15 R4.2
  Bottom 0.254: v25.2,27.94 24.88,28.25
  Bottom 0.305: 24.88,28.25 24.88,35.24 24.25,35.88 19.8,35.88 19.01,36.67 v19.01,37.15
VEXTERN  (via drill 0.51)
  Top 0.254: IC2.8 42.53,17.74
  Top 0.305: IC2.1 45.96,10.09 45.58,10.47 45.58,13.9 | 45.58,13.9 45.58,14.41 45.45,14.54 44.31,14.54 43.68,13.9 IC2.11 | 45.58,13.9 IC2.4 | D2.C | D1.C 41.39,20.95 41.14,20.7 | 42.91,17.87 42.66,17.87 IC2.8
  Bottom 0.305: IO.9 56.63,22.54 v43.3,22.54
  pour Top: 38.85,20.64 40.12,20.64 41.39,21.91 41.39,23.18 45.84,23.18 45.84,13.65 41.39,13.65 41.39,17.46 40.12,17.46 40.12,18.73 38.85,18.73
VREGEN
  Top 0.254: VR3.3 19.48,30.48 20.43,29.52 26.15,29.52 | 26.15,29.52 26.63,29.52 27.58,30.48 VR2.3 | IC1.22 26.13,29.5 26.15,29.52
VUSB  (via drill 0.51)
  Top 0.254: 42.41,10.09 IC2.14
  Top 0.305: 42.45,10.03 IC2.14 42.28,10.09 | C3.1 v40.76,7.62 40.76,10.09 | 40.76,10.09 42.02,10.09 | 38.84,12.39 38.85,12.38 39.16,12.38 RN1.5 39.19,11.66 40.76,10.09
  Top 0.406: IC2.14 42.51,10.22 | 42.02,10.09 42.41,10.09
  Top 0.508: 42.41,10.09 42.28,10.09
  Bottom 0.305: v22.98,34.29 22.98,27.62 26.15,24.45 26.15,21.91 25.52,21.27 25.52,19.84 24.72,19.05 24.72,13.81 26.47,12.06 26.47,7.93 29.96,7.93 30.28,7.62 v40.76,7.62
  pour Top (no thermals): 13.45,35.88 29.01,35.88 29.01,32.06 15.04,32.06 15.04,24.45 13.45,24.45 13.45,30.95 14.09,30.95 14.09,31.91 13.45,31.91

### Text on the board
tPlace: v.trocio | I+S 2010 | Ian Lesnet | 2010 | Jun | CC-0
tNames: PWR | USB | MODE | VREG | Bus Pirate v4.0
bNames: PWR | USB | MODE | VREG | BPv4.0 | DangerousPrototypes.com | GND | +5V | +3.3 | Vpu | ADC | AUX2 | Fulfillment by | AUX1 | AUX | Seeed Studio | www.seeedstudio.com | CS | MISO | CLK | MOSI | MCLR | +3.3V | GND | PGD | PGC
tValues: vimark
Reference: I/O header | EXT PWR | USB-OTG | GND | +5v | V+ - GND | +3v | Vpu | ADC | AUX2 | USB | AUX1 | AUX | CS | MISO | CLK | MOSI | MCLR | +3.3V | GND | DATA | CLOCK | BUS PIRATE V4.0 | CC-0 | Ian Lesnet 2010 | Programming Header | http://dangerousprototypes.com